# EAGLE design Adafruit_PN532_Shield_v1.0 (EAGLE 7.2.0)
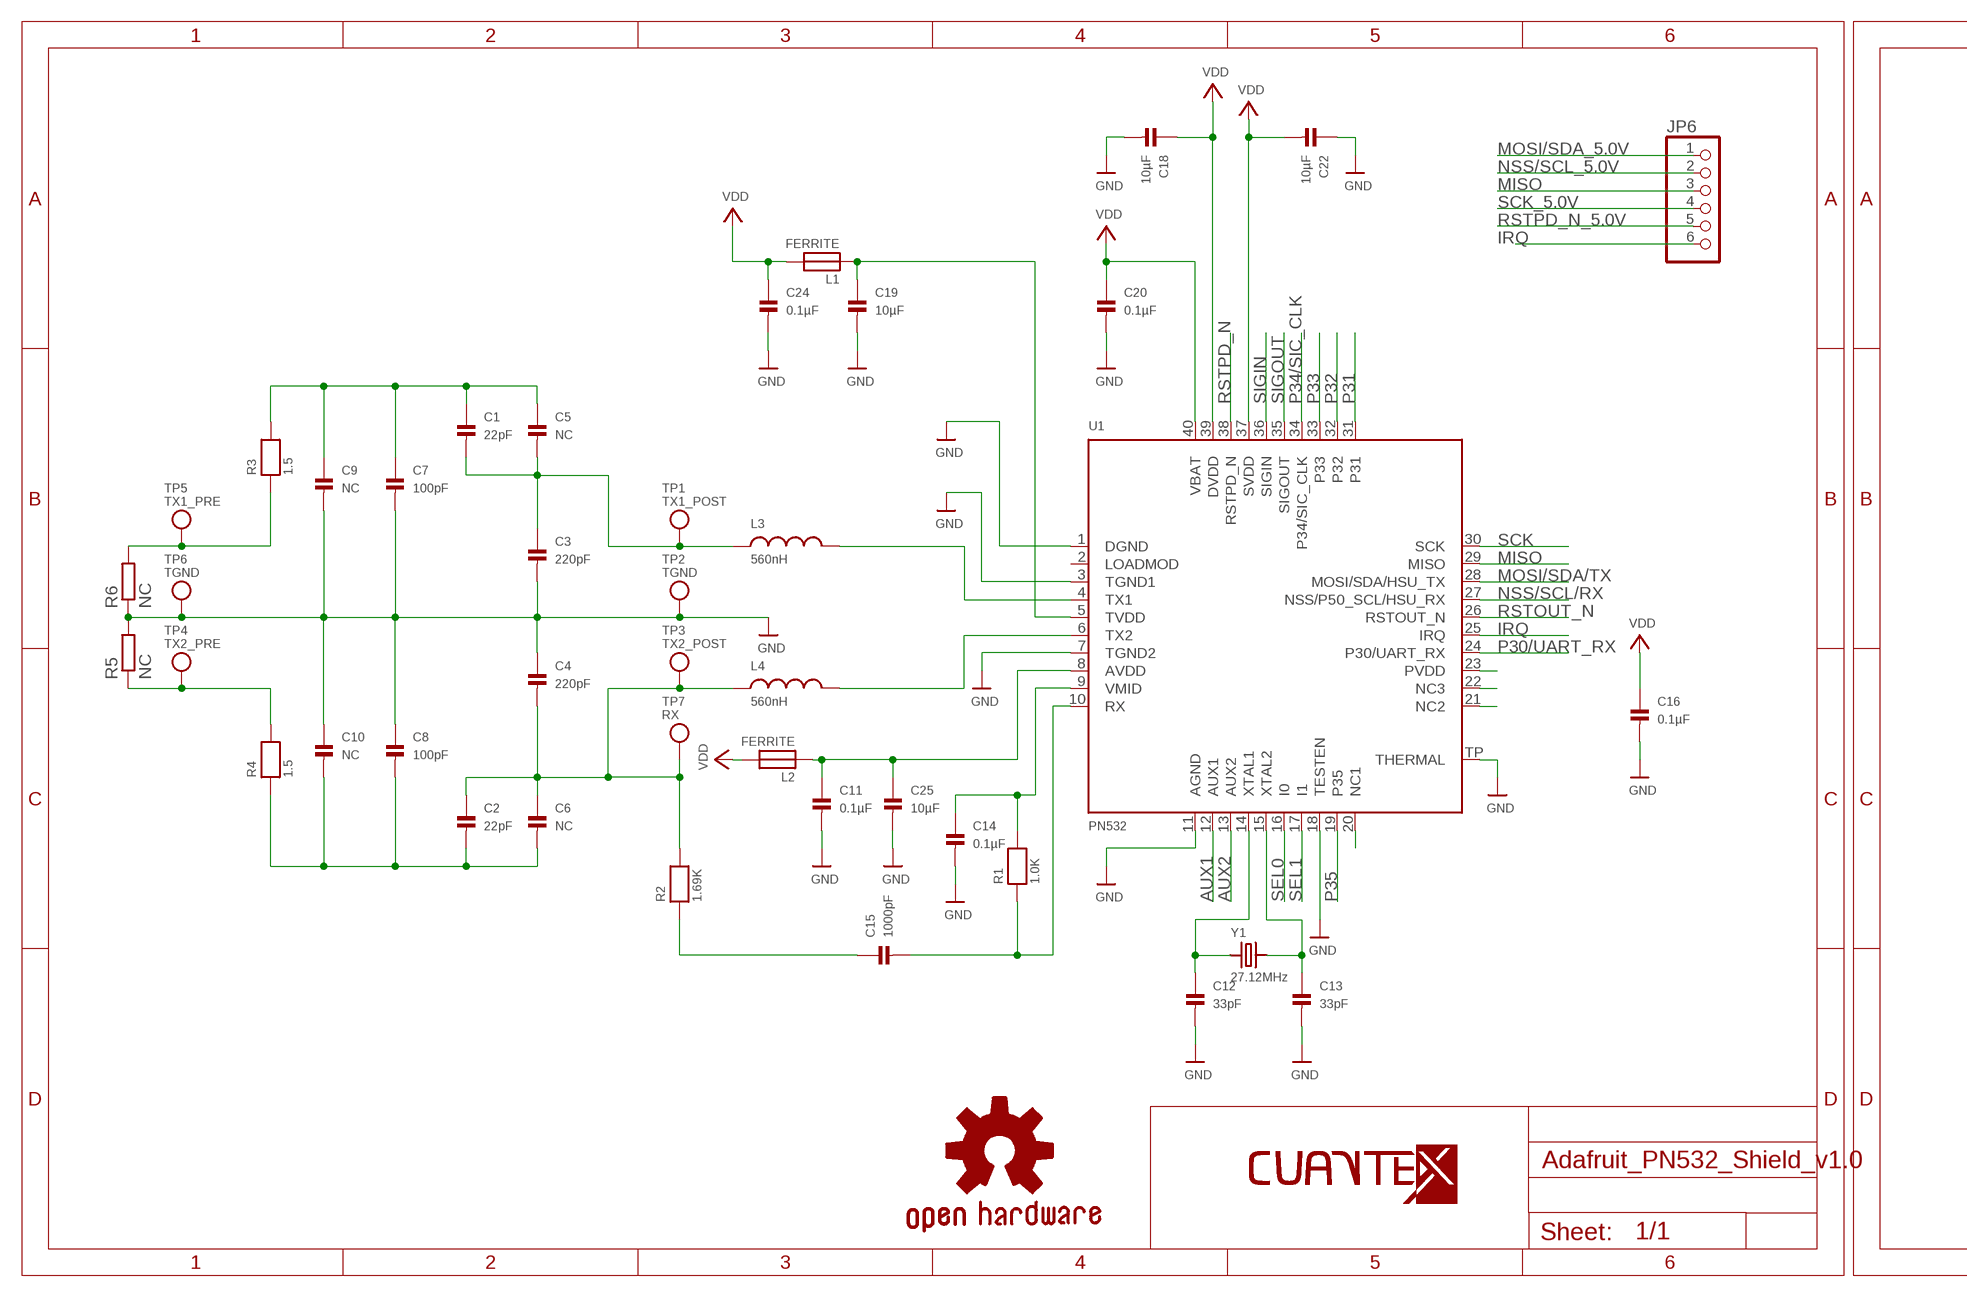
[diagram p0: schematic, sheet 1, part 1 of 2]
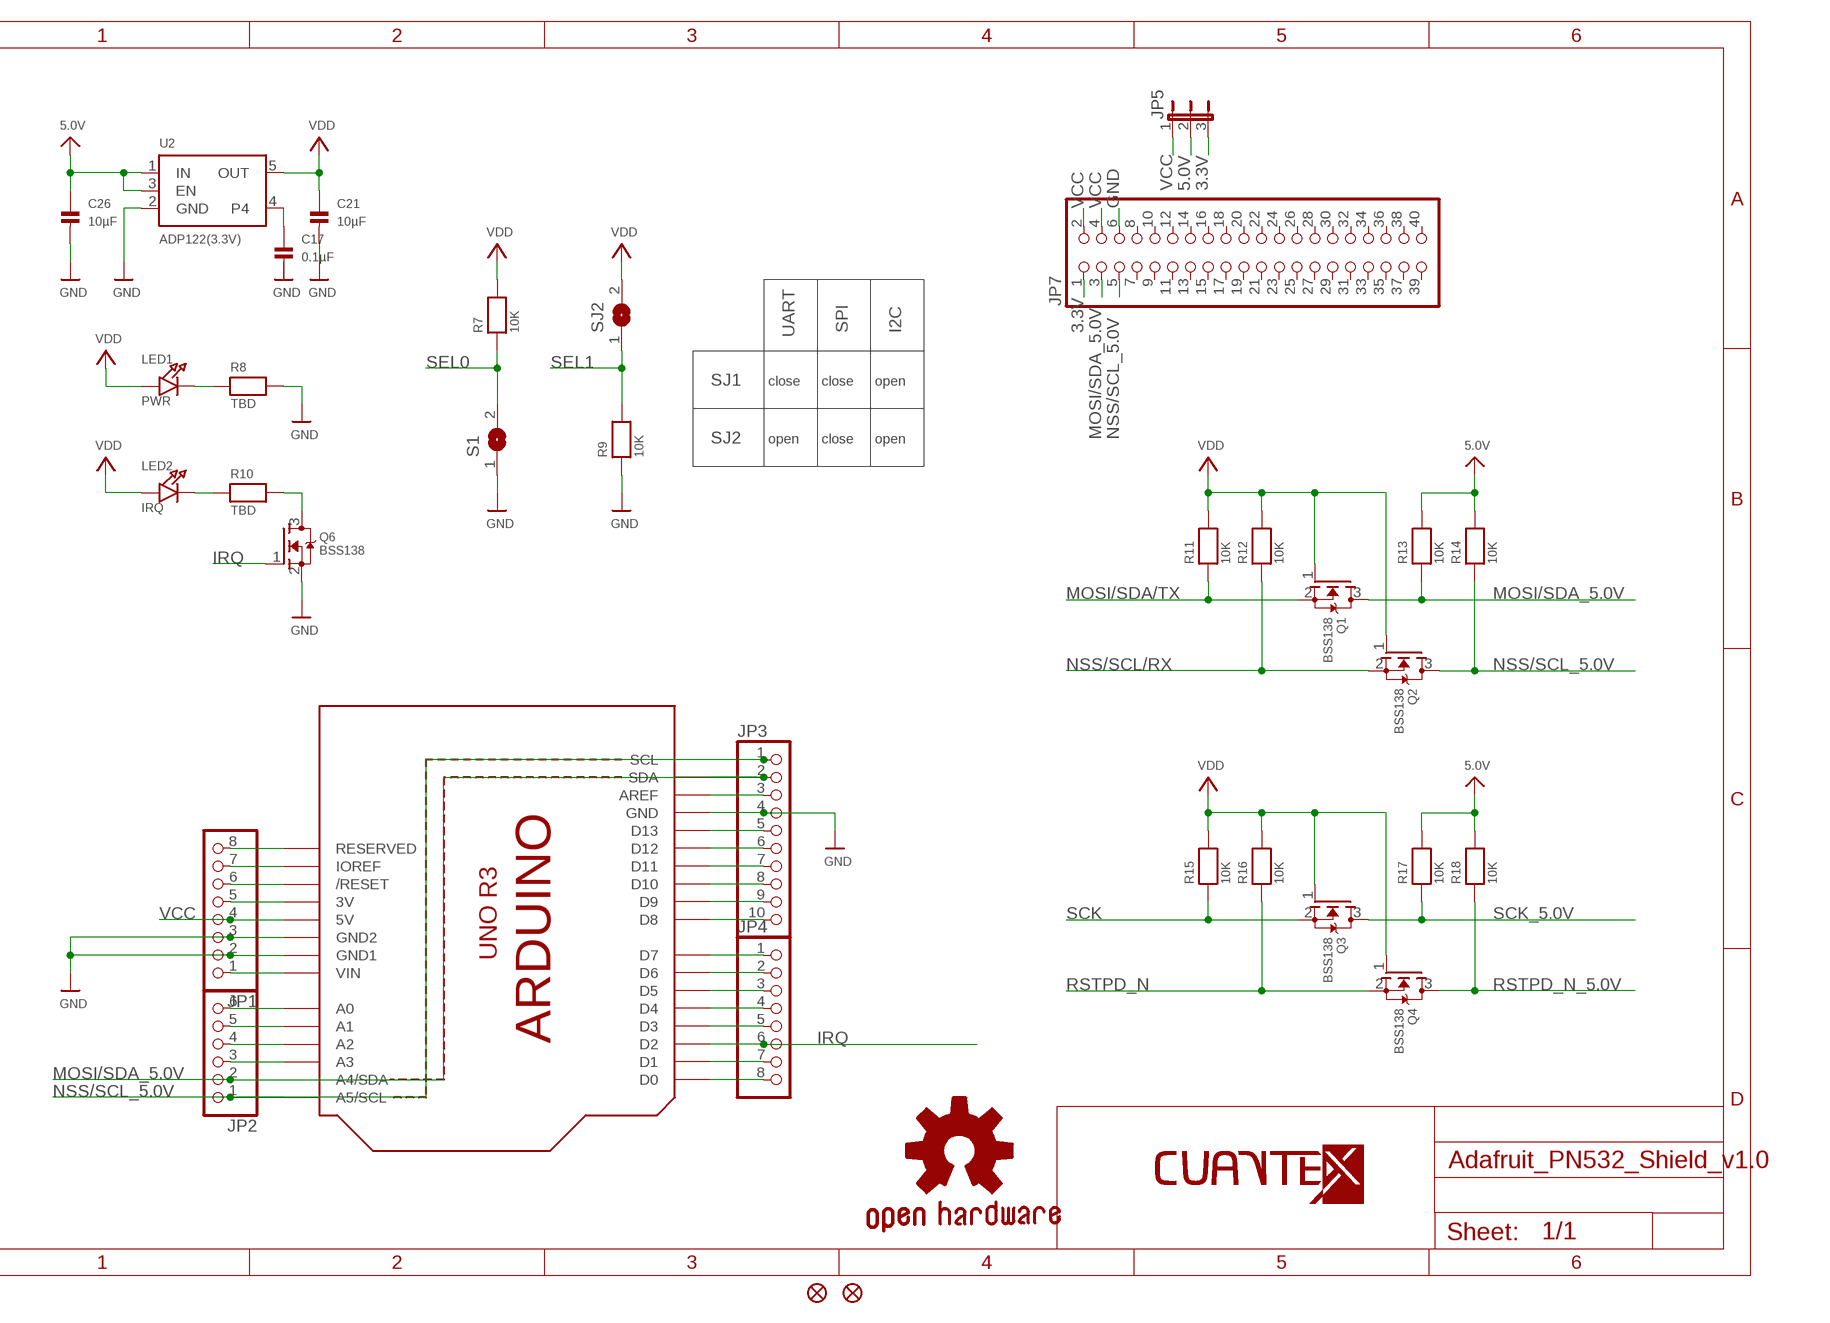
[diagram p1: schematic, sheet 1, part 2 of 2]

## Parts
C1  22pF  CAP_CERAMIC0805  [0805]
C2  22pF  CAP_CERAMIC0805  [0805]
C3  220pF  CAP_CERAMIC0805  [0805]
C4  220pF  CAP_CERAMIC0805  [0805]
C5  NC  CAP_CERAMIC0805  [0805]
C6  NC  CAP_CERAMIC0805  [0805]
C7  100pF  CAP_CERAMIC0805  [0805]
C8  100pF  CAP_CERAMIC0805  [0805]
C9  NC  CAP_CERAMIC0805  [0805]
C10  NC  CAP_CERAMIC0805  [0805]
C11  0.1µF  CAP_CERAMIC0805  [0805]
C12  33pF  CAP_CERAMIC0805  [0805]
C13  33pF  CAP_CERAMIC0805  [0805]
C14  0.1µF  CAP_CERAMIC0805  [0805]
C15  1000pF  CAP_CERAMIC0805  [0805]
C16  0.1µF  CAP_CERAMIC0805  [0805]
C17  0.1µF  CAP_CERAMIC0805  [0805]
C18  10µF  CAP_CERAMIC0805  [0805]
C19  10µF  CAP_CERAMIC0805  [0805]
C20  0.1µF  CAP_CERAMIC0805  [0805]
C21  10µF  CAP_CERAMIC0805  [0805]
C22  10µF  CAP_CERAMIC0805  [0805]
C24  0.1µF  CAP_CERAMIC0805  [0805]
C25  10µF  CAP_CERAMIC0805  [0805]
C26  10µF  CAP_CERAMIC0805  [0805]
FID1  FIDUCIAL1X2.5  [FIDUCIAL-1X2.5]
FID2  FIDUCIAL1X2.5  [FIDUCIAL-1X2.5]
GOLD_ORB_SM1  OSHWLOGO_GOLD_ORB_SM  [OSHW2]
GOLD_ORB_SM2  OSHWLOGO_GOLD_ORB_MED  [OSHW1]
JP1  HEADER-1X870MIL  [1X08_ROUND_70]
JP2  HEADER-1X670MIL  [1X06_ROUND_70]
JP3  HEADER-1X1070MIL  [1X10_ROUND70]
JP4  HEADER-1X870MIL  [1X08_ROUND_70]
JP5  JP2E  [JP2]
JP6  PINHD-1X6B  [1X06-BIG]
JP7  PINHD-2X20  [2X20]
L1  FERRITE  FERRITE0805  [0805]
L2  FERRITE  FERRITE0805  [0805]
L3  560nH  INDUCTOR0805  [0805]
L4  560nH  INDUCTOR0805  [0805]
LED1  PWR  LED0805  [CHIPLED_0805]
LED2  IRQ  LED0805  [CHIPLED_0805]
Q1  BSS138  MOSFET-NWIDE  [SOT23-WIDE]
Q2  BSS138  MOSFET-NWIDE  [SOT23-WIDE]
Q3  BSS138  MOSFET-NWIDE  [SOT23-WIDE]
Q4  BSS138  MOSFET-NWIDE  [SOT23-WIDE]
Q6  BSS138  MOSFET-NWIDE  [SOT23-WIDE]
R1  1.0K  RESISTOR0805  [0805]
R2  1.69K  RESISTOR0805  [0805]
R3  1.5  RESISTOR0805  [0805]
R4  1.5  RESISTOR0805  [0805]
R5  NC  R-EU_R0201  [R0201]
R6  NC  R-EU_R0201  [R0201]
R7  10K  RESISTOR0805  [0805]
R8  TBD  RESISTOR0805  [0805]
R9  10K  RESISTOR0805  [0805]
R10  TBD  RESISTOR0805  [0805]
R11  10K  RESISTOR0805  [0805]
R12  10K  RESISTOR0805  [0805]
R13  10K  RESISTOR0805  [0805]
R14  10K  RESISTOR0805  [0805]
R15  10K  RESISTOR0805  [0805]
R16  10K  RESISTOR0805  [0805]
R17  10K  RESISTOR0805  [0805]
R18  10K  RESISTOR0805  [0805]
S1  SOLDERJUMPERREFLOW_NOPASTE  [SOLDERJUMPER_REFLOW_NOPASTE]
SJ2  SOLDERJUMPERREFLOW_NOPASTE  [SOLDERJUMPER_REFLOW_NOPASTE]
TP1  TX1_POST  TESTPOINTPAD  [TESTPOINT_PAD_2MM]
TP2  TGND  TESTPOINTPAD  [TESTPOINT_PAD_2MM]
TP3  TX2_POST  TESTPOINTPAD  [TESTPOINT_PAD_2MM]
TP4  TX2_PRE  TESTPOINTPAD  [TESTPOINT_PAD_2MM]
TP5  TX1_PRE  TESTPOINTPAD  [TESTPOINT_PAD_2MM]
TP6  TGND  TESTPOINTPAD  [TESTPOINT_PAD_2MM]
TP7  RX  TESTPOINTPAD  [TESTPOINT_PAD_2MM]
U1  PN532  [HVQFN40-6X6]
U2  ADP122(3.3V)  VREG_SOT23-5  [SOT23-5]
U3  ARDUINOR3NODIM  [ARDUINOR3-NODIM]
U$3  LOGO-TOP-50MM  [C-3]
U$32  LOGO-TOP-100MM  [C-8]
Y1  27.12MHz  CRYSTALTHIN  [CRYSTAL_3.2X2.5]

## Nets
3.3V: JP1.5 JP5.3 JP7.1 U3.3V
5.0V: C26.1 JP5.2 R13.2 R14.2 R17.2 R18.2 U2.1(IN) U2.3(EN)
AUX1: U1.12(AUX1)
AUX2: U1.13(AUX2)
GND: C3.2 C4.1 C7.2 C8.1 C9.2 C10.1 C11.2 C12.2 C13.2 C14.2 C16.2 C17.2 C18.2 C19.2 C20.2 C21.2 C22.1 C24.2 C25.2 C26.2 JP1.2 JP1.3 JP3.4 JP7.6 Q6.2(S) R5.2 R6.1 R8.2 R9.1 S1.1 TP2.P$1 TP6.P$1 U1.1(DGND) U1.3(TGND1) U1.7(TGND2) U1.11(AGND) U1.18(TESTEN) U1.TP(THERMAL) U2.2(GND) U3.GND U3.GND1 U3.GND2
IRQ: JP4.6 JP6.6 Q6.1(G) U1.25(IRQ) U3.D2
MISO: JP6.3 U1.29(MISO)
MOSI/SDA/TX: Q1.2(S) R11.1 U1.28(MOSI/SDA/HSU_TX)
MOSI/SDA_5.0V: JP2.2 JP3.2 JP6.1 JP7.3 Q1.3(D) R13.1 U3.A4(A4/SDA) U3.SDA
N$1: L3.2 U1.4(TX1)
N$2: L4.2 U1.6(TX2)
N$3: C1.2 C3.1 C5.2 L3.1 TP1.P$1
N$4: R3.1 R6.2 TP5.P$1
N$5: R4.2 R5.1 TP4.P$1
N$6: LED1.C R8.1
N$7: C12.1 U1.14(XTAL1) Y1.1
N$8: C13.1 U1.15(XTAL2) Y1.2
N$9: C15.1 R2.1
N$10: C14.1 R1.2 U1.9(VMID)
N$11: C15.2 R1.1 U1.10(RX)
N$12: C2.1 C4.2 C6.1 L4.1 R2.2 TP3.P$1 TP7.P$1
N$13: C11.1 C25.1 L2.1 U1.8(AVDD)
N$14: C19.1 L1.1 U1.5(TVDD)
N$15: JP1.1 U3.VIN
N$17: JP1.6 U3.RESET(/RESET)
N$18: JP1.7 U3.IOREF
N$19: JP1.8 U3.RESERVED
N$20: JP2.3 U3.A3
N$21: JP2.4 U3.A2
N$22: JP2.5 U3.A1
N$23: JP2.6 U3.A0
N$24: JP3.3 U3.AREF
N$25: JP3.5 U3.D13
N$26: JP3.6 U3.D12
N$27: JP3.7 U3.D11
N$28: JP3.8 U3.D10
N$29: JP3.9 U3.D9
N$30: JP3.10 U3.D8
N$31: JP4.1 U3.D7
N$32: JP4.2 U3.D6
N$33: JP4.3 U3.D5
N$34: JP4.4 U3.D4
N$35: JP4.5 U3.D3
N$36: LED2.C R10.1
N$37: JP4.7 U3.D1
N$38: JP4.8 U3.D0
N$53: Q6.3(D) R10.2
N$54: C17.1 U2.4
N$56: U1.23(PVDD)
N$58: U1.22(NC3)
N$59: U1.21(NC2)
N$60: U1.20(NC1)
NSS/SCL/RX: Q2.2(S) R12.1 U1.27(NSS/P50_SCL/HSU_RX)
NSS/SCL_5.0V: JP2.1 JP3.1 JP6.2 JP7.5 Q2.3(D) R14.1 U3.A5(A5/SCL) U3.SCL
P30/UART_RX: U1.24(P30/UART_RX)
P31: U1.31
P32: U1.32
P33: U1.33
P34/SIC_CLK: U1.34(P34/SIC_CLK)
P35: U1.19(P35)
RSTOUT_N: U1.26(RSTOUT_N)
RSTPD_N: Q4.2(S) R16.1 U1.38(RSTPD_N)
RSTPD_N_5.0V: JP6.5 Q4.3(D) R18.1
SCK: Q3.2(S) R15.1 U1.30(SCK)
SCK_5.0V: JP6.4 Q3.3(D) R17.1
SEL0: R7.1 S1.2 U1.16(I0)
SEL1: R9.2 SJ2.1 U1.17(I1)
SIGIN: U1.36(SIGIN)
SIGOUT: U1.35(SIGOUT)
TX1_ANTENNA: C1.1 C5.1 C7.1 C9.1 R3.2
TX2_ANTENNA: C2.2 C6.2 C8.2 C10.2 R4.1
VCC: JP1.4 JP5.1 JP7.2 JP7.4 U3.5V
VDD: C16.1 C18.1 C20.1 C21.1 C22.2 C24.1 L1.2 L2.2 LED1.A LED2.A Q1.1(G) Q2.1(G) Q3.1(G) Q4.1(G) R7.2 R11.2 R12.2 R15.2 R16.2 SJ2.2 U1.37(SVDD) U1.39(DVDD) U1.40(VBAT) U2.5(OUT)
Unconnected: JP7.7 JP7.8 JP7.9 JP7.10 JP7.11 JP7.12 JP7.13 JP7.14 JP7.15 JP7.16 JP7.17 JP7.18 JP7.19 JP7.20 JP7.21 JP7.22 JP7.23 JP7.24 JP7.25 JP7.26 JP7.27 JP7.28 JP7.29 JP7.30 JP7.31 JP7.32 JP7.33 JP7.34 JP7.35 JP7.36 JP7.37 JP7.38 JP7.39 JP7.40 U1.2(LOADMOD)

## Notes on the sheet
- UART | SPI | I2C
- SJ1 | close | close | open
- SJ2 | open | close | open

## Library data of the parts
C1-C22 C24-C26 = microbuilder:CAP_CERAMIC: Ceramic Capacitors 0402 - 0402 Surface Mount Capacitors 16pF 50V 5% [Digikey: 445-4899-2-ND] 18pF 50V 5% [Digikey: 490-1281-2-ND] 22pF 50V 5% [Digikey: 490-1283-2-ND] 68pF 50V 5% [Digikey: 490-1289-2-ND] 0.1uF 10V 10% [Digikey: 490-1318-2-ND] 1.0uF 6.3V 10% [Digikey: 490-1320-2-ND] 0603 - 0603 Surface Mount Capacitors 16 pF 50V 5% [Digikey: 445-5051-2-ND] 22 pF 50V [Digikey: PCC220ACVTR-ND] 33 pF 50V 5% [Digikey: 490-1415-1-ND] 56pF 50V 5% [Digikey: 490-1421-1-ND] 220pF 50V 5% [Digikey: 445-1285-1-ND] 680 pF 50V 2200 pF 50V 5% C0G [Digikey: 445-1297-1-ND] 5600 pF 100V 5% X7R [Digikey: 478-3711-1-ND] 0.1 µF 25V 10% [Digikey: PCC2277TR-ND] 0.22 µF 16V 10% X7R [Digikey: 445-1318-1-ND] 1.0 µF 25V 10% [Digikey: 445-5146-2-ND] 0603 - RF Specific 3pF 250V +/-0.1pF RF [Digikey: 712-1347-1-ND] 18 pF 250V 5% [Digikey: 478-3505-1-ND or 712-1322-1-ND] 56 pF 250V 5% C0G RF [Digikey: 490-4867-1-ND] 68 pF 250V RF [Digikey: 490-4868-1-ND] 0805 - 0805 Surface Mount Capacitors 220 pF 250V 2% RF Ceramic Capacitor [Digikey: 712-1398-1-ND] 1000 pF 50V 2% NP0 Ceramic Capacitor [Digikey: 478-3760-1-ND] 0.1 µF 25V 10% Ceramic Capacitor [Digikey: PCC1828TR-ND] 1.0 µF 16V 10% Ceramic Capacitor[Digikey: 490-1691-2-ND] 10.0 µF 10V 10% Ceramic Capacitor[Digikey: 709-1228-1-ND] 10.0 uF 16V 10% Ceramic Capacitor [Digikey: 478-5165-2-ND] 47 uF 6.3V 20% Ceramic Capacitor [Digikey: 587-1779-1-ND or 399-5506-1-ND] 1206 - 1206 Surface Mount Capacitors 47uF 10V 20% Ceramic Capacitor [Digikey: 490-5528-1-ND or 399-5508-1-ND or 445-6010-1-ND] 100uF 6.3V -20%, +80% Y5V Ceramic Capacitor (Digikey: 490-4512-1-ND, Mouser: 81-GRM31CF50J107ZE1L)
FID1 FID2 = microbuilder:FIDUCIAL: Fiducial Alignment Points Various fiducial points for machine vision alignment.
GOLD_ORB_SM1 GOLD_ORB_SM2 = OPENHW:OSHWLOGO: These are Open-Source Hardware logos.
JP1 JP4 = microbuilder:HEADER-1X8: PIN HEADER
JP2 = microbuilder:HEADER-1X6: PIN HEADER
JP3 = microbuilder:HEADER-1X10: PIN HEADER
JP5 = jumper:JP2E: JUMPER
JP6 = adafruit:PINHD-1X6: PIN HEADER
JP7 = pinhead:PINHD-2X20: PIN HEADER
L1 L2 = microbuilder:FERRITE: Ferrite Bead 0603 MMZ1608B121C - 120 Ohm, 600mA Ferrite Chip - Digikey: 445-2164-1-ND BK1608HW121-T - 120 Ohm, 600mA Ferrite Chip - Digikey: 587-1876-2-ND
L3 L4 = microbuilder:INDUCTOR: Inductors 0603: 10nH Ceramic Inductor - microwire antenna/RF (Digikey: 712-1434-2-ND) 0805: 560nH Ceramic Inductor - RF (Digikey: 553-1047-1-ND) 1007 (2518 Metric) SMT: 10µH 10% 250mOhm 820mA 1007 Inductor (Digikey: 587-2189-1-ND) 22µH 10% 500mOhm 580mA 1007 Inductor (Digikey: 587-2190-1-ND) 47µH 10% 950mOhm 420mA 1007 Inductor (Digikey: 587-2191-1-ND) 47µH 5% 100mOhm 1A 1008 Inductor (Digikey: 732-1816-1-ND) 5.0x5.0mm (TDK VLC5045 Series) 4.7µH 20% 3.3A 34mOhm Inductor (Digikey: 445-6526-1-ND) 6.8µH 20% 2.7A 46mOhm Inductor (Digikey: 445-6527-1-ND) 6.0x6.0mm (TDK VLC6045 Series) 4.7µH 20% 3.8A 27mOhm Inductor (Digikey: 445-6538-2-ND) 6.8µH 20% 3A 41mOhm Inductor (Digikey: 445-6540-1-ND) 6.2µH 30% 2.2A 45mOhm Inductor (Digikey: SRR5028-6R2YCT-ND) - Not TDK VLC6045 but footprint should match 6.0x6.0mm (TDK SLF6045 Series) 6.8uH 30% 2A 33mOhm Inductor (Digikey: 445-4572-1-ND, Mouser: 810-SLF645T6R8N2R0PF)
LED1 LED2 = microbuilder:LED: LED 0603 - 0603 Surface Mount Package 2mA: Green LED - Low Power (3.9mcd, 2ma, 1.7Vf) - Digikey: 475-2709-2-ND Orange LED - Low Power (9.8mcd, 2ma, 1.8Vf) - Digikey: 475-1194-2-ND Red LED - Low Power (5mcd, 2ma, 1.8Vf) - Digikey: 475-1195-2-ND Yellow LED - Low Power (7mcd, 2ma, 1.8Vf) - Digikey: 475-1196-2-ND 5mA: Blue LED - Low Power (17mcd, 5ma, 2.9Vf) - Digikey: LNJ937W8CRACT-ND 0805 - 0805 Surface Mount Package 2mA: Red LED (8.8mcd, 2mA, 1.8Vf, Clear) - Low Power [Digikey: 475-2510-1-ND] Green LED (5mcd, 2mA, 1.8Vf, Clear) - Low Power [Digikey: 475-2730-1-ND] Yellow LED (11.3mcd, 2mA, 1.8Vf, Clear) - Low Power [Digikey: 475-2555-1-ND] 20mA: Red LED (104mcd, 20mA, Diffused) - LS R976 [Digikey: 475-1278-6-ND] Red LED (12mcd, 20mA, 2.0Vf, Clear) - APT2012EC [Digikey: 754-1128-1-ND] Green LED (15mcd, 20mA, 2.2Vf, Clear) - APT2012GC [Digikey: 754-1131-1-ND] Orange LED (160mcd, 20mA, 2.1Vf, Clear) - APT2012SECK [Digikey: 754-1130-1-ND] 1206 - 1206 Surface Mount Package Green LED (26mcd, 20mA, Diffused) - LG N971 [Digikey: 475-1407-6-ND] Red LED (15mcd, 20mA, Diffused) - LH N974 [Digikey: 475-1416-6-ND]
Q1-Q4 Q6 = microbuilder:MOSFET-N: N-Channel Mosfet LEGEND VDS: Voltage Drain-Source ID: Drain Current RDS(ON): Drain-Source On-State Resistance VGS(TH): Gate-Source Threshold Voltage CISS: Drain-Source Input Capacitance SOT-23 Name VDS ID RDS(ON) VGS(TH) CISS Order Number 2N7002E 60V 260mA 2.5 Ohm 2.5V @ 250uA 26.7pF @ 25V 2N7002ET1GOSTR-ND BSH103 30V 850mA 400 mOhm 400mV @ 1mA 83pF @ 24V BSH103,235-ND BSS138 60V 320mA 1.6 Ohm 1.5V @ 250uA 50pF @ 10V Mouser: 771-BSS138PW115 * BSS138 good choice for I2C level-shifting
R1-R4 R7-R18 = microbuilder:RESISTOR: Resistors 0402 - 0402 Surface Mount Package 22 Ohm 1% 1/16W [Digikey: 311-22.0LRTR-ND] 33 Ohm 5% 1/16W 1.0K 5% 1/16W 1.5K 5% 1/16W 2.0K 1% 1/16W 10.0K 1% 1/16W [Digikey: 311-10.0KLRTR-ND] 10.0K 5% 1/16W [Digikey: RMCF0402JT10K0TR-ND] 12.1K 1% 1/16W [Digikey: 311-22.0LRTR-ND] 100.0K 5% 1/16W 0603 - 0603 Surface Mount Package 0 Ohm 1/10 Watt 1% Resistor 15 Ohm 1/10 Watt 1% Resistor 33 Ohm 1/10 Watt 1% Resistor 49.9 Ohm 1/10 Watt 1% Resistor 100 Ohm 1/10 Watt 1% Resistor 150 Ohm 1/10 Watt 1% Resistor 240 Ohm 1/10 Watt 1% Resistor 390 Ohm 1/10 Watt 1% Resistor 560 Ohm 1/10 Watt 1% Resistor 680 Ohm 1/10 Watt 1% Resistor 750 Ohm 1/10 Watt 1% Resistor 1.0K Ohm 1/10 Watt 1% Resistor 1.5K Ohm 1/10 Watt 1% Resistor 2.0K Ohm 1/10 Watt 1% Resistor 2.2K Ohm 1/10 Watt 1% Resistor 3.3K Ohm 1/10 Watt 1% Resistor 4.7K Ohm 1/10 Watt 1% Resistor 10.0K Ohm 1/10 Watt 1% Resistor 12.0K Ohm 1/10 Watt 1% Resistor 12.1K Ohm 1/10 Watt 1% Resistor 20.0K Ohm 1/10 Watt 1% Resistor 33.0K Ohm 1/10 Watt 1% Resistor 100.0K Ohm 1/10 Watt 1% Resistor 0805 - 0805 Surface Mount Package 0 Ohm 1/8 Watt 1% Resistor 33 Ohm 1/8 Watt 1% Resistor 100 Ohm 1/8 Watt 1% Resistor 150 Ohm 1/8 Watt 1% Resistor 200 Ohm 1/8 Watt 1% Resistor 240 Ohm 1/8 Watt 1% Resistor 330 Ohm 1/8 Watt 1% Resistor 390 Ohm 1/8 Watt 1% Resistor 470 Ohm 1/8 Watt 1% Resistor 1.0K Ohm 1/8 Watt 1% Resistor 1.5K Ohm 1/8 Watt 1% Resistor 2.0K Ohm 1/8 Watt 1% Resistor 4.7K Ohm 1/8 Watt 1% Resistor 5.1K Ohm 1/8 Watt 1% Resistor 5.6K Ohm 1/8 Watt 1% Resistor 10.0K Ohm 1/8 Watt 1% Resistor 22.0K Ohm 1/8 Watt 1% Resistor 33.0K Ohm 1/8 Watt 1% Resistor 100K Ohm 1/8 Watt 1% Resistor 1206 - 1206 Surface Mount Package 2012 - 2010 Surface Mount Package 0.11 Ohm 1/2 Watt 1% Resistor - Digikey: RHM.11UCT-ND
R5 R6 = rcl:R-EU_: RESISTOR, European symbol
S1 SJ2 = microbuilder:SOLDERJUMPER: SMD Solder JUMPER Solder the two pads together to create a connection, or remove the solder to break it. REFLOW - Use this footprint for solder paste and reflow ovens. WAVE - Use this footprint for hand-soldering (larger pads). CLOSED - Has a trace between the two pads to ensure it is closed by default. The trace needs to be cut to disable the jumper, and can be closed again by creating a solder bridge between the two pads.
TP1-TP7 = microbuilder:TESTPOINT: Test Point TESTPOINT_SMT - Compact Surface Mount Test Point [Digikey: 5016KTR-ND] TESTPOINT_PAD - Square Pad (2mm) TESTPOINT_SMT - Round Pad (2mm) TESTPOINT_0.1" - 0.1" Header
U1 = microbuilder:PN532: PN532 - Near Field Communication (NFC) controller Highly integrated transceiver module for contactless communication at 13.56 MHz (14443A/MIFARE, FeliCa, I4443B)
U2 = microbuilder:VREG_SOT23-5: SOT23-5 Fixed Voltage Regulators To better organise some of the SOT23-5 fixed voltage regulators in this library, this new part was created. Part Current Out V Out V In V Dropout Digikey Part No. ADP121 150mA 3.3V 3.4-5.5V 0.09V @ 150mA ADP121-AUJZ33R7CT-ND ADP121 150mA 3.0V 3.1-5.5V 0.09V @ 150mA ADP121-AUJZ30R7CT-ND ADP122 300mA 3.3V 3.4-5.5V 0.085V @ 300mA ADP122AUJZ-3.3-R7CT-ND ADP1712 300mA 3.3V 3.5-5.5V 0.17V @ 300mA ADP1712AUJZ-3.3-R7TR-ND AP7311 (Low Cost) 150mA 3.3V 3.5-6V 0.15V @ 150mA AP7311-33WG-7DICT-ND LD39015M18R 150mA 1.8V 1.9V-5.5V 0.08V @ 100mA 497-6977-1-ND MCP1824T-3302E/OT 300mA 3.3V 3.5V-6V 0.2V @ 300mA MCP1824T-3302E/OTCT-ND MIC5205-2.5YM5 TR 150mA 2.5V 2.7-16V 0.165V @ 150mA 576-1257-2-ND MIC5205-3.0YM5 TR 150mA 3.0V 3.2V-16V 0.165V @ 150mA 576-1258-2-ND MIC5205-3.3YM5 TR 150mA 3.3V 3.5V-16V 0.165V @ 150mA 576-1259-2-ND TPS780330220 150mA 3.3V+2.2V 3.6-5.5V 250mV Max 296-23332-1-ND TDA3663/N1,135 100mA 3.3V 3.5-45V 0.18V @ 50mA 568-5343-1-ND
U3 = microbuilder:ARDUINOR3: This is a new object for the new Arduino R3 - with extra pins that you may want to use (such as IOref, and duplicated A4/A5
U$3 = LOGOTIPOS:LOGO-TOP-50MM
U$32 = LOGOTIPOS:LOGO-TOP-100MM
Y1 = microbuilder:CRYSTAL: Crystals HC49UP - Surface Mount Crystal 4.0MHz 18pF +/-30ppm Surface Mount Crystal [Digikey: 535-9857-1-ND] 12.0 MHz Surface Mount Crystal [Digikey: 535-9869-6-ND] 25.0 MHz Surface Mount Crystal [Digikey: 535-9078-1-ND] 3.2 x 2.5mm - MEMs SMT Crystal 12.0 MHz 8pF 15ppm 3.2 x 2.5mm Crystal [Digikey: -10-70°C: 644-1047-1-ND -40-125°C: 644-1128-1-ND] 16.0 MHz 8pF 15ppm 3.2 x 2.5mm Crystal [Digikey: -10-70°C: 644-1049-1-ND -40-125°C: 644-1129-2-ND] 16.0 MHz 10pF 10ppm 3.2 x 2.5mm Crystal [Digikey: 644-1100-1-ND] 27.12 MHz 18pF 30ppm 3.2 x 2.5mm Crystal [Digikey: 887-1424-1-ND] 27.12MHz 10pF 10ppm 3.2 x 2.5mm Crystal [Digikey: 887-1329-1-ND] 4.9 x 1.8mm - MEMs SMT Crystal 32.768 KHz 12.5pF 20ppm 4.9 x 1.8mm Crystal [Digikey: SE2415CT-ND] Cylinder 32.768KHz Cylinder Crystal

## Board
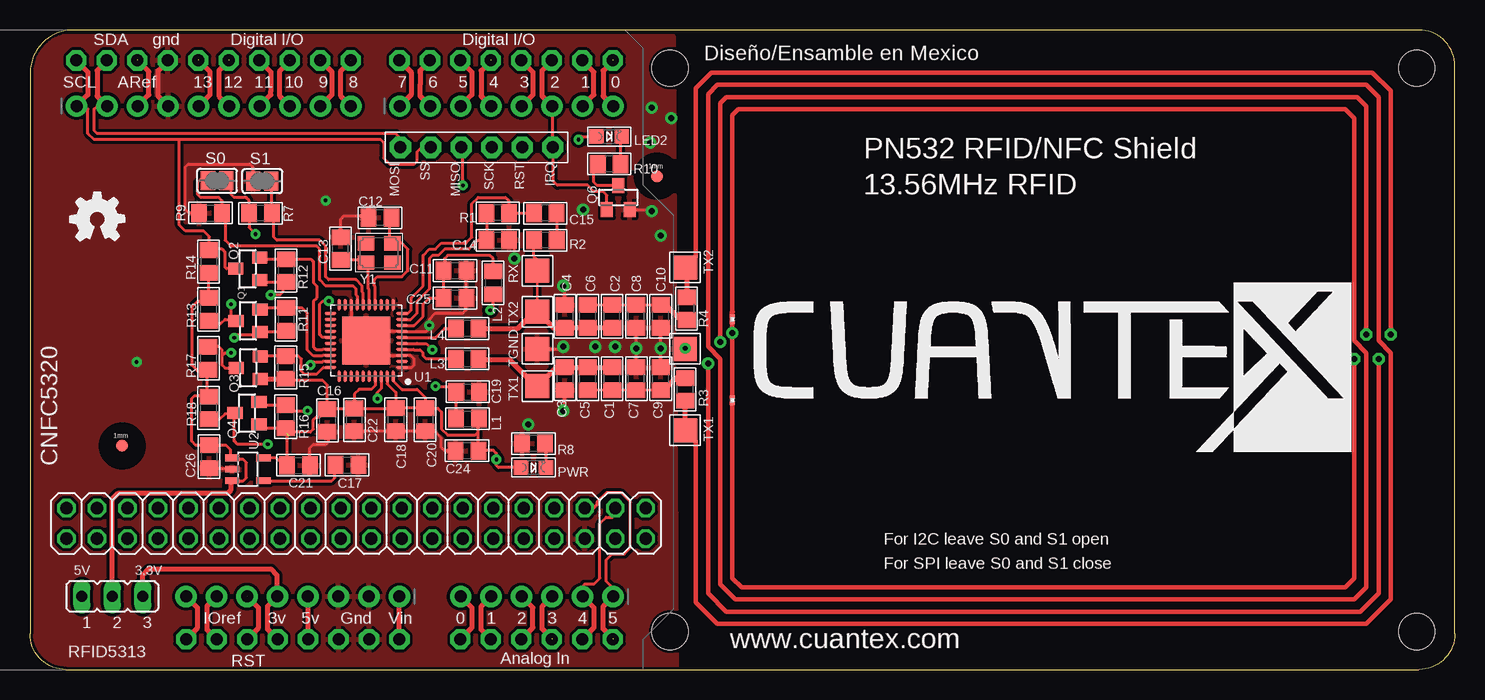
[diagram p2: board, top side]
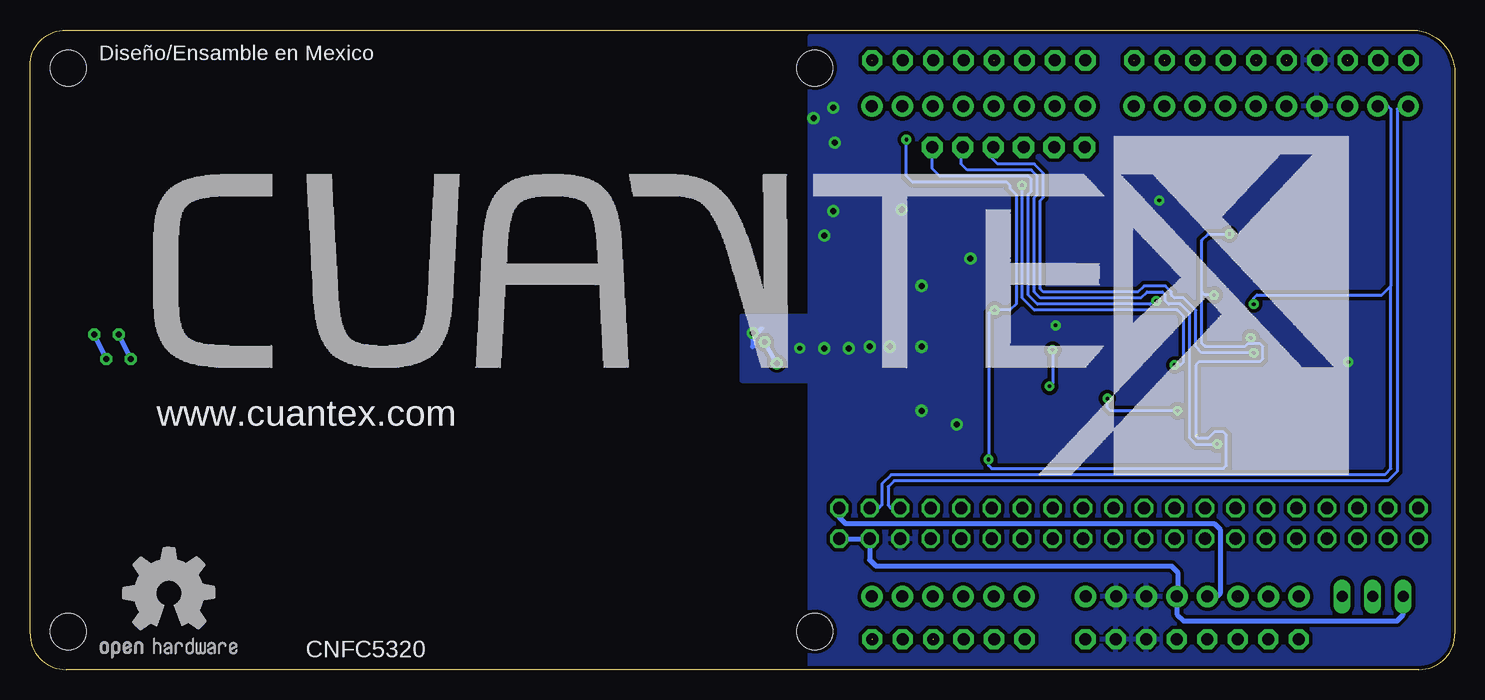
[diagram p3: board, bottom side, seen from below]

Size 118.75 x 53.34 mm. Coordinates in mm from the lower left corner, seen from the top.
Outline: 3,0 115.73,0 arc90 118.75,3 118.75,50.34 arc90 115.73,53.34 3.76,53.34 arc90 0,49.83 0,3 arc90 3,0
Copper layers (1*16): Top 0.035mm / dielectric 1.5mm / Bottom 0.035mm
Design rules "cuantex2layerdrc": minimum track width 8mil, minimum drill 0.3mm, track to track 8mil, track to pad 8mil, pad to pad 8mil, via to via 8mil, smd to smd 0mil, copper to edge 10mil, drill to drill 10mil, minimum pad ring 10mil, minimum via ring 10mil, stop-mask expansion 4mil, vias tented up to drill 0mil, thermal gap 10mil
Holes 3 mm at 53.34,50.16 115.57,50.16 115.57,3.18 53.34,3.18

### Footprints (pad centres in the part's own frame; a part is rotated, then mirrored left to right if it is on the bottom)
0805 = smd 1.3 x 1.5: 1 -0.95,0; 2 0.95,0
FIDUCIAL-1X2.5 = smd 1 x 1: 1 0,0
1X08_ROUND_70 = drill 1 pad 1.778: 1 -8.89,0; 2 -6.35,0; 3 -3.81,0; 4 -1.27,0; 5 1.27,0; 6 3.81,0; 7 6.35,0; 8 8.89,0
1X06_ROUND_70 = drill 1 pad 1.778: 1 -6.35,0; 2 -3.81,0; 3 -1.27,0; 4 1.27,0; 5 3.81,0; 6 6.35,0
1X10_ROUND70 = drill 1 pad 1.778: 1 -11.43,0; 2 -8.89,0; 3 -6.35,0; 4 -3.81,0; 5 -1.27,0; 6 1.27,0; 7 3.81,0; 8 6.35,0; 9 8.89,0; 10 11.43,0
JP2 = drill 0.914 long: 1 -2.54,0; 2 0,0; 3 2.54,0
1X06-BIG = drill 1.016 pad 1.778 octagon: 1 -6.35,0; 2 -3.81,0; 3 -1.27,0; 4 1.27,0; 5 3.81,0; 6 6.35,0
2X20 = drill 1.016 octagon: 1 -24.13,-1.27; 2 -24.13,1.27; 3 -21.59,-1.27; 4 -21.59,1.27; 5 -19.05,-1.27; 6 -19.05,1.27; 7 -16.51,-1.27; 8 -16.51,1.27; 9 -13.97,-1.27; 10 -13.97,1.27; 11 -11.43,-1.27; 12 -11.43,1.27; 13 -8.89,-1.27; 14 -8.89,1.27; 15 -6.35,-1.27; 16 -6.35,1.27; 17 -3.81,-1.27; 18 -3.81,1.27; 19 -1.27,-1.27; 20 -1.27,1.27; 21 1.27,-1.27; 22 1.27,1.27; 23 3.81,-1.27; 24 3.81,1.27; 25 6.35,-1.27; 26 6.35,1.27; 27 8.89,-1.27; 28 8.89,1.27; 29 11.43,-1.27; 30 11.43,1.27; 31 13.97,-1.27; 32 13.97,1.27; 33 16.51,-1.27; 34 16.51,1.27; 35 19.05,-1.27; 36 19.05,1.27; 37 21.59,-1.27; 38 21.59,1.27; 39 24.13,-1.27; 40 24.13,1.27
CHIPLED_0805 = smd 1.2 x 1.2: A 0,-1.05; C 0,1.05
SOT23-WIDE = smd 1 x 1.27: 1 -0.95,-1; 2 0.95,-1; 3 0,1
R0201 = smd 0.28 x 0.43: 1 -0.255,0; 2 0.255,0
SOLDERJUMPER_REFLOW_NOPASTE = smd 1.168 x 1.6: 1 -0.762,0; 2 0.762,0
TESTPOINT_PAD_2MM = smd 2 x 2: P$1 0,0
HVQFN40-6X6 = smd 1 x 0.25: 1 -2.99,2.25; 2 -2.99,1.75; 3 -2.99,1.25; 4 -2.99,0.75; 5 -2.99,0.25; 6 -2.99,-0.25; 7 -2.99,-0.75; 8 -2.99,-1.25; 9 -2.99,-1.75; 10 -2.99,-2.25; 21 2.99,-2.25; 22 2.99,-1.75; 23 2.99,-1.25; 24 2.99,-0.75; 25 2.99,-0.25; 26 2.99,0.25; 27 2.99,0.75; 28 2.99,1.25; 29 2.99,1.75; 30 2.99,2.25 | smd 0.25 x 1: 11 -2.25,-2.99; 12 -1.75,-2.99; 13 -1.25,-2.99; 14 -0.75,-2.99; 15 -0.25,-2.99; 16 0.25,-2.99; 17 0.75,-2.99; 18 1.25,-2.99; 19 1.75,-2.99; 20 2.25,-2.99; 31 2.25,2.99; 32 1.75,2.99; 33 1.25,2.99; 34 0.75,2.99; 35 0.25,2.99; 36 -0.25,2.99; 37 -0.75,2.99; 38 -1.25,2.99; 39 -1.75,2.99; 40 -2.25,2.99 | smd 4 x 4: TP 0,0
SOT23-5 = smd 0.55 x 1.2: 1 -0.95,-1.3; 2 0,-1.3; 3 0.95,-1.3; 4 0.95,1.3; 5 -0.95,1.3
ARDUINOR3-NODIM = drill 1 pad 1.676 octagon: 3V 35.56,2.54; 5V 38.1,2.54; A0 50.8,2.54; A1 53.34,2.54; A2 55.88,2.54; A3 58.42,2.54; A4 60.96,2.54; A5 63.5,2.54; AREF 23.876,50.8; D0 63.5,50.8; D1 60.96,50.8; D2 58.42,50.8; D3 55.88,50.8; D4 53.34,50.8; D5 50.8,50.8; D6 48.26,50.8; D7 45.72,50.8; D8 41.656,50.8; D9 39.116,50.8; D10 36.576,50.8; D11 34.036,50.8; D12 31.496,50.8; D13 28.956,50.8; GND 26.416,50.8; GND1 43.18,2.54; GND2 40.64,2.54; IOREF 30.48,2.54; RESERVED 27.94,2.54; RESET 33.02,2.54; SCL 18.796,50.8; SDA 21.336,50.8; VIN 45.72,2.54
CRYSTAL_3.2X2.5 = smd 1.4 x 1.2: 1 -1.1,-0.8; 2 1.1,0.8; GND1 -1.1,0.8; GND2 1.1,-0.8

### Placement (x,y rotation side)
C1  48.5,24.26 90 top
C2  48.5,29.46 90 top
C3  44.57,24.26 270 top
C4  44.57,29.46 270 top
C5  46.48,24.26 90 top
C6  46.48,29.46 90 top
C7  50.53,24.26 90 top
C8  50.53,29.46 90 top
C9  52.56,24.26 90 top
C10  52.56,29.46 90 top
C11  35.42,33.27 0 top
C12  29.16,37.67 180 top
C13  25.88,35.11 90 top
C14  38.98,35.81 0 top
C15  42.94,38.06 180 top
C16  24.78,20.78 270 top
C17  26.42,17.07 0 top
C18  30.48,20.84 270 top
C19  36.47,23.16 0 top
C20  32.92,20.84 270 top
C21  22.38,17.04 0 top
C22  27.04,20.83 90 top
C24  36.42,18.24 180 top
C25  35.42,30.99 0 top
C26  14.92,17.76 270 top
FID1  7.68,18.67 180 top
FID2  52.25,41.15 180 top
GOLD_ORB_SM1  1.78,33.27 0 top
GOLD_ORB_SM2  113.54,-0.76 0 bottom
JP1  21.89,6.1 180 top
JP2  42.24,6.1 180 top
JP3  15.32,46.99 0 top
JP4  39.7,46.99 0 top
JP5  6.86,6.1 0 top
JP6  37.21,43.56 0 top
JP7  27.18,12.19 180 top
L1  36.46,20.93 0 top
L2  38.59,32.26 270 top
L3  36.43,25.91 180 top
L4  36.43,28.45 180 top
LED1  41.95,16.85 270 top
LED2  48.26,44.45 270 top
Q1  18.16,29.08 90 top
Q2  18.14,33.43 90 top
Q3  18.19,25.17 90 top
Q4  18.08,21.39 90 top
Q6  49.02,39.37 0 top
R1  38.98,38.09 180 top
R2  42.95,35.8 180 top
R3  54.59,23.36 90 top
R4  54.71,30.1 90 top
R5  58.53,22.48 270 top
R6  58.53,29.21 90 top
R7  19.2,38.05 180 top
R8  41.95,18.85 180 top
R9  15.04,38.07 0 top
R10  48.26,42.16 180 top
R11  21.34,29.21 270 top
R12  21.34,33.27 270 top
R13  14.88,30.05 90 top
R14  14.88,34.04 270 top
R15  21.31,25.2 270 top
R16  21.31,21.08 270 top
R17  14.86,25.96 270 top
R18  14.88,21.82 90 top
S1  19.35,40.74 0 top
SJ2  15.6,40.77 0 top
TP1  42.28,23.64 180 top
TP2  42.28,26.74 180 top
TP3  42.28,29.85 180 top
TP4  54.59,33.53 180 top
TP5  54.59,19.96 180 top
TP6  54.58,26.74 180 top
TP7  42.28,33.27 180 top
U1  28.02,27.45 180 top
U2  18.15,16.7 270 top
U3  -14.93,0 0 top
U$3  60.2,18.03 0 top
U$32  108.71,16 0 bottom
Y1  29.1,34.75 180 top

### Tracks (layer width: path | path; a pad name or v marks a point on that pad's centre or on a via)
3.3V
  Top 0.406: U3.3V 19.81,3.36 19.81,5.28 JP1.5 20.57,6.15 20.57,7.87 20.07,8.38 9.91,8.38 9.4,7.87 JP5.3
  Bottom 0.406: JP7.1 51.31,12.7 50.8,12.19 20.07,12.19 19.56,11.68 19.56,6.35 19.81,6.1 JP1.5
5.0V
  Top 0.254: R13.2 R14.2 | U2.3 17.78,15.75 18.03,16 18.03,17.27 17.78,17.53 16.98,17.53 U2.1 16.72,17.78 16.72,18.33 16.34,18.71 C26.1 13.8,18.71 13.46,19.05 13.46,22.61 13.72,22.86 14.79,22.86 R18.2 | 14.87,30.73 13.97,30.73 13.46,30.23 13.46,25.4 13.97,24.89 14.74,24.89 | 14.72,22.61 R18.2 | 14.74,24.89 R17.2 | 14.74,24.89 14.74,22.91 R18.2
  Top 0.406: JP5.2 6.86,14.22 7.37,14.73 16.51,14.73 16.76,14.99 16.76,15.66 U2.3 | R13.2 14.87,30.73
GND  (via drill 0.3, 0.4, 0.5)
  Top 0.203: v40.37,34.29 40.37,35.52
  Top 0.254: C8.1 v50.53,26.8 C7.2 | C10.1 v52.56,26.8 v52.56,26.79 C9.2 | v54.59,26.8 54.64,26.8 TP6.P$1 | C4.1 44.57,31.88 v44.45,32 | C3.2 44.57,21.71 v44.45,21.59 | TP2.P$1 44.27,26.74 v44.45,26.92 | C25.2 C11.2 | 27.05,19.89 C18.2 C20.2 33.7,19.89 34.29,19.3 34.29,18.54 34.59,18.24 C24.2 | U1.18 26.77,29.11 26.92,28.96 | R9.1 13.23,38.08 12.95,38.35 12.95,41.91 13.21,42.16 18.29,42.16 18.54,41.91 18.54,40.79 S1.1 | C13.2 25.88,37.56 26.16,37.85 28.04,37.85 C12.2 | 40.37,35.52 40.22,35.52 C14.2 | U1.1 31.8,25.2 32,25.4 32,25.91 31.71,26.2 U1.3 30.97,26.16 29.46,26.16 28.18,27.45 U1.TP 28.76,28.19 29.46,28.19 29.47,28.2 U1.7 33.03,28.2 33.27,28.45 v33.27,28.7 33.27,29.21 33.78,29.72 36.07,29.72 36.32,29.97 36.32,30.94 C25.2 | U2.2 16.79,16.76 15.49,16.76 | C21.2 23.33,18.5 23.62,18.8 24.64,18.8 24.89,19.05 24.89,19.72 C16.2 | 14.97,16.76 15.49,16.76 | Q6.2 51.66,38.37 v51.8,38.23 | C25.2 36.37,31.03 36.58,31.24 | C26.2 15.45,16.81 15.49,16.76
  Top 0.356: R5.2 v58.53,28.07 R6.1
  Top 0.406: R6.1 58.53,29.84 | U1.TP 26.92,27.45 26.92,28.96 | 11.51,50.8 10.67,49.96 10.67,47.83 JP3.4
  Bottom 0.254: v44.45,32 44.45,32.26 | v44.45,21.59 44.45,21.84 | v44.45,26.92 44.7,26.92 | v40.37,34.29 40.39,34.29 | v33.27,28.7 33.02,28.7 | 58.53,26.92 58.53,27.57 57.66,28.45 57.91,28.45 58.17,28.19
  Bottom 0.406: v58.53,28.07 58.53,26.92
  other vias: 53.45,45.97 52.56,36.2 48.75,26.92 47.1,26.92 46.09,38.35 41.51,20.45 51.67,43.94 51.8,46.86 8.89,25.65 24.64,39.12
  pour Bottom (isolate 0.305): 53.71,52.83 0.11,53.09 0.11,-0.04 53.71,-0.04
  pour Bottom (isolate 0.254): 53.34,29.46 59.44,29.46 59.44,24.13 53.34,24.13
  pour Top (isolate 0.254): 0,52.83 53.59,52.83 53.85,0 0.25,0
IRQ  (via drill 0.3)
  Top 0.254: U1.25 24.37,27.7 24.13,27.94 24.13,30.48 24.38,30.73 v24.89,30.73 | Q6.1 48.07,39.56 47.75,39.88 46.99,39.88 46.48,40.39 43.94,40.39 43.56,40.77 JP6.6 43.56,46.94 JP4.6
  Top 0.406: U3.D2 42.67,49.98 42.67,47.83 JP4.6
  Bottom 0.254: v24.89,30.73 25.15,30.73 25.4,30.48 34.8,30.48 35.56,31.24 35.56,39.62 35.31,39.88 35.31,40.89 35.56,41.15 42.93,41.15 43.56,41.78 JP6.6
MISO  (via drill 0.3)
  Top 0.254: U1.29 24.43,25.7 24.38,25.65 23.62,25.65 v23.37,25.4 | v36.07,40.39 36.07,43.43 JP6.3
  Bottom 0.254: v36.07,40.39 36.07,30.99 35.05,29.97 23.11,29.97 22.61,29.46 22.61,25.65 22.86,25.4 v23.37,25.4
MOSI/SDA/TX
  Top 0.254: U1.28 24.42,26.2 24.38,26.16 23.62,26.16 23.11,26.67 23.11,29.72 22.67,30.16 R11.1 19.29,30.16 Q1.2
MOSI/SDA_5.0V  (via drill 0.3)
  Top 0.254: 16.76,29.21 17.03,29.21 Q1.3 16.76,29.48 v16.76,30.48 16.76,29.21 | 16.76,29.21 16.26,29.21 15.89,28.84 15.14,28.84 R13.1 | 6.35,46.91 JP3.2 5.59,46.99 5.33,46.74 5.33,44.96 5.59,44.7 30.48,44.7 30.86,44.32 JP6.1 | JP7.3 48.77,12.95 48.51,12.7 48.01,12.7 47.5,12.19 47.5,7.62 46.99,7.11 46.23,7.11 45.97,6.86 45.97,6.17 JP2.2
  Top 0.406: U3.SDA 5.59,49.98 5.59,47.83 JP3.2 | JP2.2 46.99,5.16 46.99,3.5 U3.A4
  Bottom 0.254: v16.76,30.48 16.76,30.99 16.51,31.24 6.1,31.24 5.33,32 | JP3.2 5.59,46.99 5.33,46.74 5.33,32 | 5.33,32 5.33,16.76 5.84,16.26 46.99,16.26 47.75,15.49 47.75,13.72 48.01,13.46 JP7.3
N$1
  Top 0.254: L3.2 33.02,25.91 32.77,26.16 32.77,26.42 32.51,26.67 32,26.67 31.97,26.7 U1.4
N$2
  Top 0.254: U1.6 33.8,27.7 34.54,28.45 L4.2
N$3
  Top 0.203: 46.99,25.21 C5.2 | L3.1 37.45,25.84 | 42.83,24.17 42.28,24.17 42.28,24.26
  Top 0.254: 42.83,23.68 42.78,23.64 42.4,23.64 41.66,24.38 | TP1.P$1 42.29,23.64 42.85,24.2
  Top 0.406: 42.83,24.17 42.85,24.2 43.87,25.21 C3.1 C5.2 | 37.45,25.84 39.93,25.84 41.39,24.38 41.66,24.38 42.15,24.38 42.28,24.26 | 46.99,25.21 C1.2
N$4
  Top 0.356: TP5.P$1 55.48,19.07 55.48,5.6 57.26,3.81 111.36,3.81 113.4,5.84 113.4,26.42 112.38,27.43 112.38,47.75 111.36,48.77 57.26,48.77 56.5,48.01 56.5,26.92 57.52,25.91 57.52,7.11 58.79,5.84 110.35,5.84 111.36,6.86 111.36,26.42 110.35,27.43 110.35,45.97 109.59,46.74 59.04,46.74 58.53,46.23 R6.2
  Top 0.406: TP5.P$1 R3.1
N$5  (via drill 0.5)
  Top 0.356: v113.4,27.94 113.4,48.26 111.87,49.78 56.75,49.78 55.48,48.51 55.48,34.42 TP4.P$1 | v112.38,25.91 112.38,6.35 110.86,4.83 58.02,4.83 56.5,6.35 v56.5,25.53 | v57.52,27.3 57.52,47.24 58.02,47.75 110.6,47.75 111.36,46.99 v111.36,27.94 | v110.35,25.91 110.35,7.62 109.59,6.86 59.29,6.86 58.53,7.62 R5.1 58.53,22.86
  Top 0.406: R4.2 54.71,33.4 TP4.P$1
  Bottom 0.406: v112.38,25.91 v113.4,27.94 | v56.5,25.53 v57.52,27.3 | v111.36,27.94 v110.35,25.91
N$6
  Top 0.254: LED1.C 43,18.75 R8.1
N$7
  Top 0.254: U1.14 28.77,31.94 28.7,32 28.7,32.51 28.96,32.77 30.99,32.77 31.5,33.27 31.5,35.05 30.99,35.56 30.22,35.56 Y1.1 | 30.2,37.67 C12.1 29.97,37.53 29.97,35.78 Y1.1 | Y1.1 29.96,35.55 29.7,35.29
N$8
  Top 0.254: U1.15 28.27,31.67 28.19,31.75 28.19,33.76 Y1.2 28,33.74 27.59,34.16 C13.1 25.88,33.81 25.91,33.78 26.16,34.04 | 25.97,33.74 25.97,33.97 25.91,34.04 26.16,34.04 | 26.42,34.04 26.16,34.04
N$9
  Top 0.254: R2.1 43.94,35.85 43.94,37.34 43.89,37.39 C15.1
N$10
  Top 0.254: U1.9 31.74,29.2 32.26,29.72 32.26,30.73 33.27,31.75 33.27,34.29 33.53,34.54 34.04,34.54 34.54,35.05 36.58,35.05 37.33,35.81 C14.1 | C14.1 38.1,35.88 38.1,38.02 R1.2 | 37.96,35.81 38.1,35.81 C14.1
N$11
  Top 0.254: U1.10 31.48,29.7 31.75,29.97 31.75,30.99 32.77,32 32.77,34.54 33.27,35.05 33.78,35.05 34.29,35.56 36.32,35.56 36.83,36.07 36.83,38.86 37.34,39.37 39.62,39.37 39.88,39.12 39.88,38.14 R1.1 39.96,38.06 C15.2
N$12
  Top 0.203: L4.1 37.45,28.51 | TP3.P$1 TP7.P$1
  Top 0.254: TP7.P$1 42.28,34.18 42,34.46 R2.2
  Top 0.406: C2.1 C6.1 C4.2 44.51,28.45 43.69,28.45 TP3.P$1 41.77,29.34 41.51,29.34 40.62,28.45 L4.1
N$13
  Top 0.254: U1.8 32,28.7 32.77,29.46 32.77,30.48 33.27,30.99 C25.1 C11.1 34.54,33.35 34.54,34.29 34.8,34.54 38.35,34.54 38.59,34.3 L2.1
N$14  (via drill 0.3)
  Top 0.254: U1.5 32.24,27.2 32.26,27.18 33.02,27.18 v33.53,26.67 | L1.1 35.52,20.95 C19.1 35.06,23.62 v33.78,23.62
  Bottom 0.254: v33.53,26.67 33.53,23.88 v33.78,23.62
N$15
  Top 0.406: U3.VIN JP1.1
N$17  (1 unrouted)
  Top 0.406: JP1.6 19.05,5.13 19.05,3.5 U3.RESET
N$18
  Top 0.406: JP1.7 14.73,5.28 14.73,3.36 U3.IOREF
N$19
  Top 0.406: JP1.8 13.97,5.13 13.97,3.5 U3.RESERVED
N$20  (1 unrouted)
  Top 0.406: JP2.3 42.67,5.26 42.67,3.4 43.51,2.56
N$21
  Top 0.406: JP2.4 41.91,5.16 41.91,3.5 U3.A2
N$22
  Top 0.406: JP2.5 37.59,5.26 37.59,3.36 U3.A1
N$23
  Top 0.406: JP2.6 36.83,5.16 36.83,3.5 U3.A0
N$24  (1 unrouted)
  Top 0.406: JP3.3 9.91,47.93 9.91,49.86 8.97,50.8
N$25  (1 unrouted)
  Top 0.406: 14.05,50.8 14.99,49.86 14.99,47.93 JP3.5
N$26  (1 unrouted)
  Top 0.406: 16.59,50.8 15.75,49.96 15.75,47.83 JP3.6
N$27
  Top 0.406: U3.D11 20.07,49.84 20.07,48.77 20.07,48.26 20.07,47.93 JP3.7
N$28  (1 unrouted)
  Top 0.406: 21.67,50.8 20.83,49.96 20.83,47.83 JP3.8
N$29  (1 unrouted)
  Top 0.406: 24.21,50.8 25.15,49.86 25.15,47.93 JP3.9
N$30  (1 unrouted)
  Top 0.406: 26.75,50.8 25.91,49.96 25.91,47.83 JP3.10
N$31
  Top 0.406: U3.D7 31.75,49.84 31.75,47.93 JP4.1
N$32
  Top 0.406: U3.D6 32.51,49.98 32.51,49.78 32.51,48.77 32.51,47.83 JP4.2
N$33
  Top 0.406: U3.D5 36.83,49.84 36.83,47.93 JP4.3
N$34  (1 unrouted)
  Top 0.406: 38.43,50.8 37.59,49.96 37.59,47.83 JP4.4
N$35
  Top 0.406: U3.D3 41.91,49.84 41.91,47.93 JP4.5
N$36
  Top 0.254: R10.1 49.21,44.35 LED2.C
N$37
  Top 0.406: U3.D1 46.99,49.84 46.99,47.93 JP4.7
N$38  (1 unrouted)
  Top 0.406: 48.59,50.8 47.75,49.96 47.75,47.83 JP4.8
N$53
  Top 0.254: Q6.3 47.26,40.37 46.99,40.64 46.99,41.84 R10.2
N$54
  Top 0.254: C17.1 25.4,17 25.4,16 25.15,15.75 U2.4
NSS/SCL/RX
  Top 0.254: U1.27 24.41,26.7 24.38,26.67 23.88,26.67 23.75,26.8 23.62,26.92 23.62,30.73 23.88,30.99 23.88,32 23.62,32.26 23.62,34.04 23.43,34.22 R12.1 19.29,34.22 Q2.2
NSS/SCL_5.0V  (1 unrouted)
  Top 0.254: 12.45,44.2 29.21,44.2 29.46,43.94 29.46,42.67 29.97,42.16 32,42.16 32.26,42.42 32.26,43.18 32.64,43.56 JP6.2 | 12.45,44.2 5.33,44.2 4.83,44.7 4.83,46.74 4.57,46.99 JP3.1 3.81,46.99 | 12.45,44.2 12.45,37.08 12.95,36.58 14.48,36.58 14.95,36.1 14.95,35.05 | JP2.1 48.51,6.17 48.51,6.86 48.01,7.37 48.01,9.14 48.51,9.65 49.53,9.65 50.04,10.16 50.04,13.97 49.28,14.73 48.01,14.73 47.24,13.97 47.24,13.72 46.99,13.46 JP7.5 | Q2.3 16.36,33.43 16.26,33.53 16.26,34.8 16,35.05 14.95,35.05 | 14.95,35.05 R14.1
  Top 0.406: U3.SCL 4.83,49.84 4.83,47.93 JP3.1 3.81,46.91 | JP2.1 47.75,5.26 47.75,3.4 48.59,2.56
  Bottom 0.254: 3.81,46.99 4.57,46.99 4.83,46.74 4.83,16.51 5.59,15.75 46.74,15.75 47.24,15.24 47.24,13.72 46.99,13.46 JP7.5
  Bottom 0.406: 3.81,46.99 JP3.1
RSTPD_N  (via drill 0.3)
  Top 0.254: U1.38 29.27,23.43 28.96,23.11 v28.96,22.61 | v23.11,21.59 21.63,21.59 21.57,21.52 21.57,21.78 R16.1 19.39,22.03 Q4.2
  Bottom 0.254: 28.96,22.35 v28.96,22.61 28.96,21.84 28.7,21.59 v23.11,21.59
RSTPD_N_5.0V  (via drill 0.3)
  Top 0.254: v19.81,18.8 17.27,18.8 17.02,19.05 17.02,21.32 Q4.3 | 17.03,21.34 Q4.3 | R18.1 15.79,20.87 16.26,21.34 16.51,21.34 16.56,21.39 Q4.3
  Bottom 0.254: v19.81,18.8 21.59,18.8 22.1,19.3 22.1,29.72 22.86,30.48 23.88,30.48 24.13,30.73 24.13,31.24 24.38,31.5 25.65,31.5 26.16,30.99 34.54,30.99 35.05,31.5 35.05,39.37 34.8,39.62 34.8,41.15 35.31,41.66 40.64,41.66 41.15,42.16 41.15,43.43 JP6.5
SCK
  Top 0.254: R15.1 19.21,26.15 Q3.2 | U1.30 24.69,25.2 | 21.35,26.15 R15.1 | R15.1 21.33,26.16 22.35,26.16 22.61,25.91 22.61,24.89 22.86,24.64 23.88,24.64 24.44,25.2 U1.30 | 24.95,25.2 U1.30
SCK_5.0V  (via drill 0.3)
  Top 0.254: v16.76,26.42 16.26,26.42 16.02,26.18 | 16.02,26.18 16.02,25.39 16.26,25.15 17.16,25.15 Q3.3 | 16.02,26.18 16.02,26.66 15.75,26.92 14.87,26.92 R17.1
  Bottom 0.254: v16.76,26.42 21.08,26.42 21.59,26.92 21.59,29.97 22.61,30.99 23.37,30.99 23.62,31.24 23.62,31.5 24.13,32 25.91,32 26.42,31.5 34.29,31.5 34.54,31.75 34.54,39.12 34.29,39.37 34.29,41.4 35.05,42.16 38.1,42.16 38.61,42.67 38.61,43.43 JP6.4
SEL0
  Top 0.254: U1.16 27.77,31.41 27.69,31.5 27.69,32 27.18,32.51 24.89,32.51 24.64,32.77 24.64,35.31 24.13,35.81 20.57,35.81 20.32,36.07 20.32,37.88 R7.1 20.15,40.71 S1.2
SEL1
  Top 0.254: 16,38.06 R9.2 | SJ2.1 14.71,40.89 14.22,40.89 13.97,40.64 13.97,39.62 14.22,39.37 15.75,39.37 15.99,39.13 R9.2 | U1.17 27.27,31.15 27.18,31.24 27.18,31.75 26.92,32 24.64,32 24.13,32.51 24.13,35.05 23.88,35.31 16.76,35.31 16.26,35.81 16.26,37.8 R9.2
TX1_ANTENNA
  Top 0.203: C9.1 C7.1 C1.1 C5.1
  Top 0.254: C9.1 52.56,23.66 52.61,23.71
  Top 0.406: 52.61,23.71 53.2,23.71 53.81,24.32 R3.2
TX2_ANTENNA
  Top 0.203: C10.2 C8.2 C2.2 C6.2
  Top 0.406: C10.2 52.97,30.41 54.06,29.32 54.55,29.32 R4.1
VCC
  Top 0.254: JP1.4
  Top 0.406: U3.5V JP1.4
  Bottom 0.406: JP7.2 JP7.4 48.77,9.14 48.26,8.64 23.62,8.64 23.11,8.13 23.11,6.15 JP1.4 23.16,4.62 22.61,4.06 4.83,4.06 4.32,4.57 JP5.1
VDD  (via drill 0.3)  (1 unrouted)
  Top 0.254: 30.48,21.84 C18.1 27.13,21.79 | U1.40 30.27,24.09 30.99,23.37 32.26,23.37 32.92,22.71 C20.1 | 27.04,22.97 C22.2 27.02,21.79 24.85,21.79 C16.1 | R11.2 21.46,28.13 19.36,28.13 | C20.1 33.98,21.79 | 33.98,21.79 34.29,21.49 | 34.29,21.49 34.29,20.07 34.8,19.56 37.08,19.56 37.34,19.81 | C16.1 24.78,23.73 24.38,24.13 21.43,24.13 R15.2 | C16.1 | 37.58,18.03 C24.1 37.42,18.29 37.59,18.29 | 21.34,17.02 21.21,16.89 21.28,16.89 | 19.36,28.13 Q1.1 18.97,27.94 17.27,27.94 v17.02,27.69 | 19.36,28.13 19.3,28.19 | 19.27,32.48 Q2.1 19.3,32.31 21.32,32.31 R12.2 21.08,32.07 21.08,31.5 20.83,31.24 v20.07,31.24 | 19.34,32.48 19.27,32.48 | 19.27,32.48 19.05,32.26 | v18.8,36.32 18.25,36.87 R7.2 18.25,39.15 18.03,39.37 17.02,39.37 16.76,39.62 16.76,40.39 16.51,40.64 16.48,40.64 SJ2.2 | 37.59,18.29 38.61,18.29 38.86,18.03 v38.86,17.53 38.86,17.02 39.03,16.85 LED1.A | 21.28,16.89 20.52,17.65 U2.5 19.33,17.53 19.3,17.53 | Q4.1 19.39,20.13 21.27,20.13 | 21.27,20.13 R16.2 | 24.13,21.08 24.14,21.08 C16.1 | 21.28,16.89 C21.1 21.43,19.65 21.59,19.81 21.34,20.07 | 24.13,21.08 24.64,21.59 | 24.64,21.59 25.4,21.59 | U1.39 29.77,23.82 30.48,23.11 30.48,21.84 | 30.48,21.84 32.26,21.84 | 32.26,21.84 32.87,21.84 C20.1 | 21.34,20.07 21.34,20.11 | 21.34,20.11 R16.2 | 21.27,20.13 21.34,20.07 | v45.72,44.2 45.97,44.45 LED2.A | v38.35,29.97 38.59,30.21 L2.2 | U1.37 28.77,23.69 28.45,23.37 27.43,23.37 27.04,22.97 | 27.04,22.97 27.03,22.96 27.03,21.95 26.92,21.84 | 21.43,20.01 R16.2 | 37.59,18.29 37.34,18.54 37.34,20.86 L1.2 | R16.2 21.34,20.13 21.34,20.11 | 24.13,21.08 23.88,21.08 23.62,20.83 23.62,20.07 23.37,19.81 21.63,19.81 R16.2
  Top 0.254: 24.64,21.59 24.84,21.79 29.92,21.79 29.97,21.84 30.48,21.84 | 32.26,21.84 32.31,21.79 33.98,21.79 | 33.98,21.79 34.29,21.49 | 34.29,21.49
  Top 0.406: Q3.1 21.31,24.22 R15.2
  Bottom 0.254: 21.08,31.5 21.08,35.81 20.57,36.32 v18.8,36.32 | v20.07,31.24 20.83,31.24 21.08,31.5 | 21.08,31.5 21.08,27.18 20.83,26.92 17.53,26.92 17.27,27.18 16.76,27.18 | 16.76,27.18 16.26,27.18 16,26.92 16,25.91 16.26,25.65 21.34,25.65 21.59,25.4 21.59,19.47 21.43,19.3 20.57,19.3 20.07,19.81 19.3,19.81 19.05,19.56 19.05,17.02 19.3,16.76 38.61,16.76 38.86,17.02 v38.86,17.53 38.86,29.72 38.61,29.97 v38.35,29.97 37.08,29.97 36.58,30.48 36.58,39.62 37.08,40.13 37.08,40.39 37.34,40.64 45.21,40.64 45.72,41.15 v45.72,44.2 | 16.76,27.18 17.02,27.43 v17.02,27.69

### Text on the board
tPlace: CNFC5320
bPlace: CNFC5320
tNames: Diseño/Ensamble en Mexico | PN532 RFID/NFC Shield | S0 | S1 | MOSI | SS | MISO | SCK | RST | IRQ | 13.56MHz RFID | TX2 | RX | C4 | C6 | C2 | C8 | C10 | R4 | TX2 | L4 | L3 | TGND | R3 | TX1 | C3 | C5 | C1 | C7 | C9 | TX1 | PWR | For I2C leave S0 and S1 open | For SPI leave S0 and S1 close | 5V | 3.3V | RFID5313 | www.cuantex.com
bNames: Diseño/Ensamble en Mexico | www.cuantex.com